# EAGLE design analogControlBoardV1_3 (EAGLE 6.4)
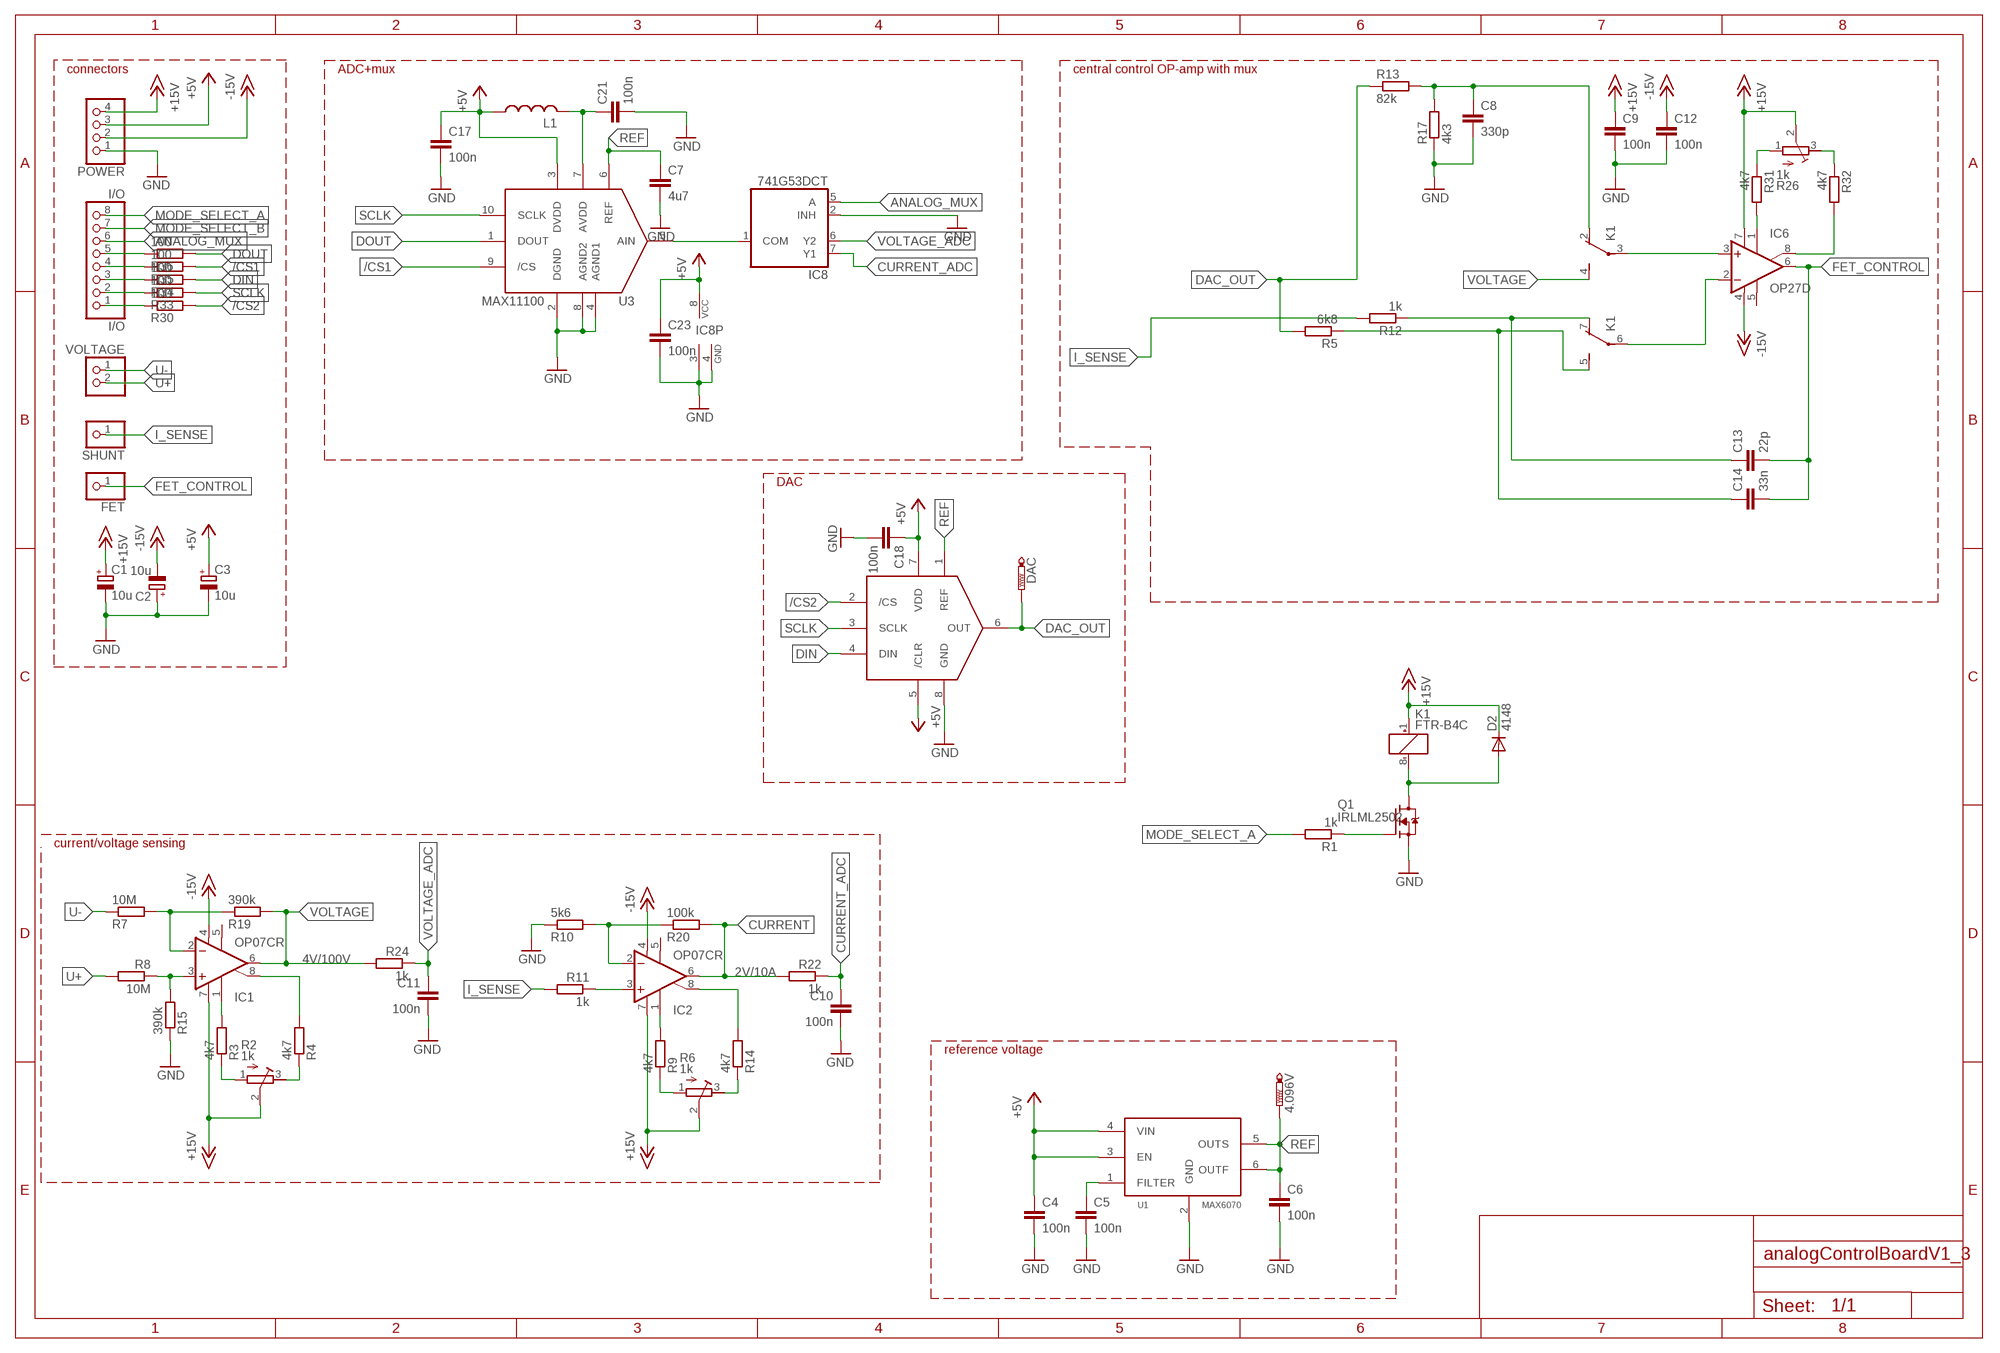
[diagram p0: schematic, sheet 1]

## Parts
4.096V  PTR1TP14R  [TP14R]
C1  10u  CPOL-EU153CLV-0505  [153CLV-0505]
C2  10u  CPOL-EU153CLV-0505  [153CLV-0505]
C3  10u  CPOL-EU153CLV-0505  [153CLV-0505]
C4  100n  C-EUC0603K  [C0603K]
C5  100n  C-EUC0603K  [C0603K]
C6  100n  C-EUC0603K  [C0603K]
C7  4u7  C-EUC0805  [C0805]
C8  330p  C-EUC0603K  [C0603K]
C9  100n  C-EUC0603K  [C0603K]
C10  100n  C-EUC0603K  [C0603K]
C11  100n  C-EUC0603K  [C0603K]
C12  100n  C-EUC0603K  [C0603K]
C13  22p  C-EUC0603K  [C0603K]
C14  33n  C-EUC0603K  [C0603K]
C17  100n  C-EUC0603K  [C0603K]
C18  100n  C-EUC0603K  [C0603K]
C21  100n  C-EUC0603K  [C0603K]
C23  100n  C-EUC0603K  [C0603K]
D2  4148  DIODE-SOD123  [SOD123]
DAC  PTR1TP14R  [TP14R]
FET  PINHD-1X1  [1X01]
I/O  I/O  PINHD-1X8  [1X08]
IC1  OP07CR  [SO08]
IC2  OP07CR  [SO08]
IC6  OP27D  [SO08]
IC8  741G53DCT  [DCT_R-PDSO-G8]
K1  FTR-B4C  [FTR-B4C]
L1  INDUCTOR0603  [R0603]
POWER  PINHD-1X4  [1X04]
Q1  IRLML2502  [SOT23-3]
R1  1k  R-EU_R0603  [R0603]
R2  1k  R-TRIMM64W  [RTRIM64W]
R3  4k7  R-EU_R0603  [R0603]
R4  4k7  R-EU_R0603  [R0603]
R5  6k8  R-EU_R0603  [R0603]
R6  1k  R-TRIMM64W  [RTRIM64W]
R7  10M  R-EU_R0603  [R0603]
R8  10M  R-EU_R0603  [R0603]
R9  4k7  R-EU_R0603  [R0603]
R10  5k6  R-EU_R0603  [R0603]
R11  1k  R-EU_R0603  [R0603]
R12  1k  R-EU_R0603  [R0603]
R13  82k  R-EU_R0603  [R0603]
R14  4k7  R-EU_R0603  [R0603]
R15  390k  R-EU_R0603  [R0603]
R17  4k3  R-EU_R0603  [R0603]
R19  390k  R-EU_R0603  [R0603]
R20  100k  R-EU_R0603  [R0603]
R22  1k  R-EU_R0603  [R0603]
R24  1k  R-EU_R0603  [R0603]
R26  1k  R-TRIMM64W  [RTRIM64W]
R30  100  R-EU_R0603  [R0603]
R31  4k7  R-EU_R0603  [R0603]
R32  4k7  R-EU_R0603  [R0603]
R33  100  R-EU_R0603  [R0603]
R34  100  R-EU_R0603  [R0603]
R35  100  R-EU_R0603  [R0603]
R36  100  R-EU_R0603  [R0603]
SHUNT  PINHD-1X1  [1X01]
U1  MAX6070  [SOT23-6L]
U2  MAX5216  [UMAX8]
U3  MAX11100  [UMAX10]
VOLTAGE  PINHD-1X2  [1X02]

## Nets
+5V: C3.+ C4.1 C17.1 C18.1 C23.1 IC8.8(VCC) L1.1 POWER.3 U1.3(EN) U1.4(VIN) U2.5(/CLR) U2.7(VDD) U3.3(DVDD)
+15V: C1.+ C9.1 D2.C IC1.7(V+) IC2.7(V+) IC6.7(V+) K1.1(K:+) POWER.4 R2.2(S) R6.2(S) R26.2(S)
-15V: C2.- C12.1 IC1.4(V-) IC2.4(V-) IC6.4(V-) POWER.2
/CS1: R35.2 U3.9(/CS)
/CS2: R30.2 U2.2(/CS)
ANALOG_MUX: I/O.6 IC8.5(A)
CURRENT: IC2.6(OUT) R20.2 R22.2
CURRENT_ADC: C10.1 IC8.7(Y1) R22.1
DAC_OUT: DAC.TP R5.2 R13.1 U2.6(OUT)
DIN: R34.2 U2.4(DIN)
DOUT: R36.2 U3.1(DOUT)
FET_CONTROL: C13.2 C14.2 FET.1 IC6.6(OUT)
GND: C1.- C2.+ C3.- C4.2 C5.2 C6.2 C7.2 C8.2 C9.2 C10.2 C11.2 C12.2 C17.2 C18.2 C21.2 C23.2 IC8.2(INH) IC8.3(GND) IC8.4(GND) POWER.1 Q1.2(S) R10.1 R15.1 R17.1 U1.2(GND) U2.8(GND) U3.2(DGND) U3.4(AGND1) U3.8(AGND2)
I_SENSE: R11.2 R12.2 SHUNT.1
MODE_SELECT_A: I/O.8 R1.2
MODE_SELECT_B: I/O.7
N$1: C8.1 K1.2(-1:O) R13.2 R17.2
N$2: D2.A K1.8(K:-) Q1.3(D)
N$3: Q1.1(G) R1.1
N$4: C13.1 K1.7(-2:O) R12.1
N$5: IC2.3(+IN) R11.1
N$6: IC2.2(-IN) R10.2 R20.1
N$7: R2.1(E) R3.1
N$8: IC1.8(ON2) R4.2
N$9: R26.3(A) R32.1
N$10: R2.3(A) R4.1
N$11: IC6.1(ON1) R31.2
N$12: IC1.1(ON1) R3.2
N$13: R6.1(E) R9.1
N$14: IC2.8(ON2) R14.2
N$15: R6.3(A) R14.1
N$16: IC2.1(ON1) R9.2
N$17: I/O.5 R36.1
N$18: I/O.4 R35.1
N$19: I/O.3 R34.1
N$20: I/O.2 R33.1
N$21: I/O.1 R30.1
N$23: IC6.3(+IN) K1.3(-1:P)
N$25: C5.1 U1.1(FILTER)
N$32: IC6.2(-IN) K1.6(-2:P)
N$43: C14.1 K1.5(-2:S) R5.1
N$45: R26.1(E) R31.1
N$46: IC6.8(ON2) R32.2
N$61: C21.1 L1.2 U3.7(AVDD)
N$65: IC8.1(COM) U3.5(AIN)
N$85: IC1.3(+IN) R8.1 R15.2
N$86: IC1.2(-IN) R7.2 R19.1
REF: 4.096V.TP C6.1 C7.1 U1.5(OUTS) U1.6(OUTF) U2.1(REF) U3.6(REF)
SCLK: R33.2 U2.3(SCLK) U3.10(SCLK)
U+: R8.2 VOLTAGE.2
U-: R7.1 VOLTAGE.1
VOLTAGE: IC1.6(OUT) K1.4(-1:S) R19.2 R24.2
VOLTAGE_ADC: C11.1 IC8.6(Y2) R24.1
Unconnected: IC1.5(OPT) IC2.5(OPT) IC6.5(OPT)

## Notes on the sheet
- connectors | ADC+mux | central control OP-amp with mux
- DAC
- current/voltage sensing
- 4V/100V
- 2V/10A
- reference voltage

## Library data of the parts
4.096V DAC = testpad:PTR1: TEST PIN
C1-C3 = rcl:CPOL-EU: POLARIZED CAPACITOR, European symbol
C4-C14 C17 C18 C21 C23 = rcl:C-EU: CAPACITOR, European symbol
D2 = diode:DIODE-: DIODE
FET SHUNT = pinhead:PINHD-1X1: PIN HEADER
I/O = pinhead:PINHD-1X8: PIN HEADER
IC1 IC2 = linear:OP07*: OP AMP
IC6 = linear:OP27: OP AMP
IC8 = 74xx-little-us:74*1G53: SINGLE-POLE DOUBLE-THROW (SPDT) ANALOG SWITCH 2:1 ANALOG MULTIPLEXER/DEMULTIPLEXER Source: http://focus.ti.com/lit/ds/symlink/sn74lvc2g53.pdf
K1 = relay:FTR-B4: ULTRA MINIATURE RELAY 2 POLES - 2 A (Slim Profile Signal Relay) FUJITSU FTR-B4 SERIES Source: FTR-B4.pdf
L1 = xmaker:INDUCTOR: Inductor
POWER = pinhead:PINHD-1X4: PIN HEADER
Q1 = xmaker:IRLML2502: International Rectifier N-MOSFET.
R1 R3-R5 R7-R15 R17 R19 R20 R22 R24 R30-R36 = resistor:R-EU_: RESISTOR, European symbol
R2 R6 R26 = resistor:R-TRIMM: Trimm resistor
U1 = maxim:MAX6070
U2 = maxim:MAX5216
U3 = maxim:MAX11100
VOLTAGE = pinhead:PINHD-1X2: PIN HEADER

## Board
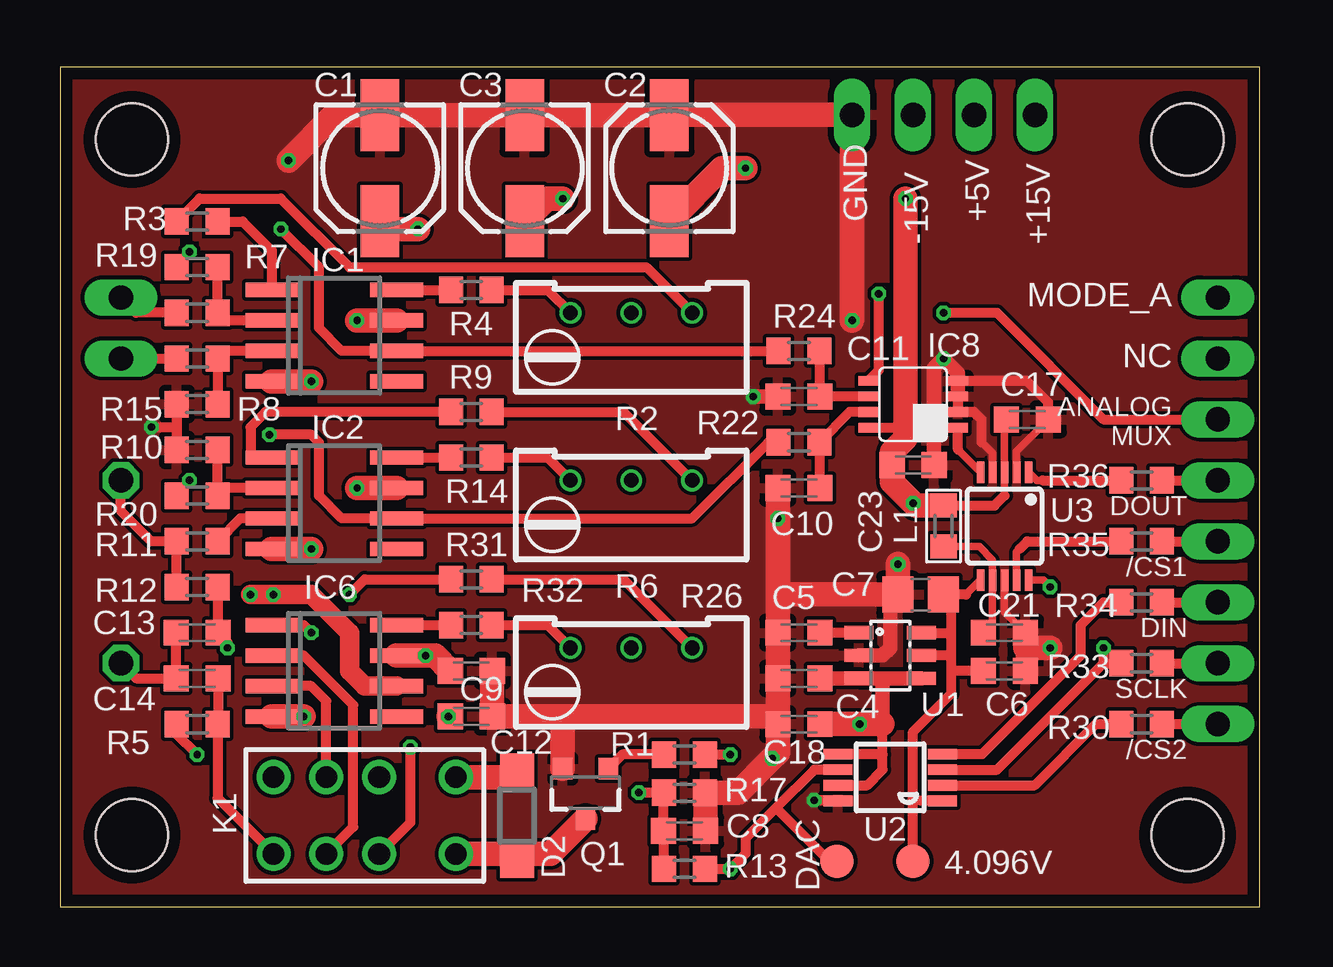
[diagram p1: board, top side]
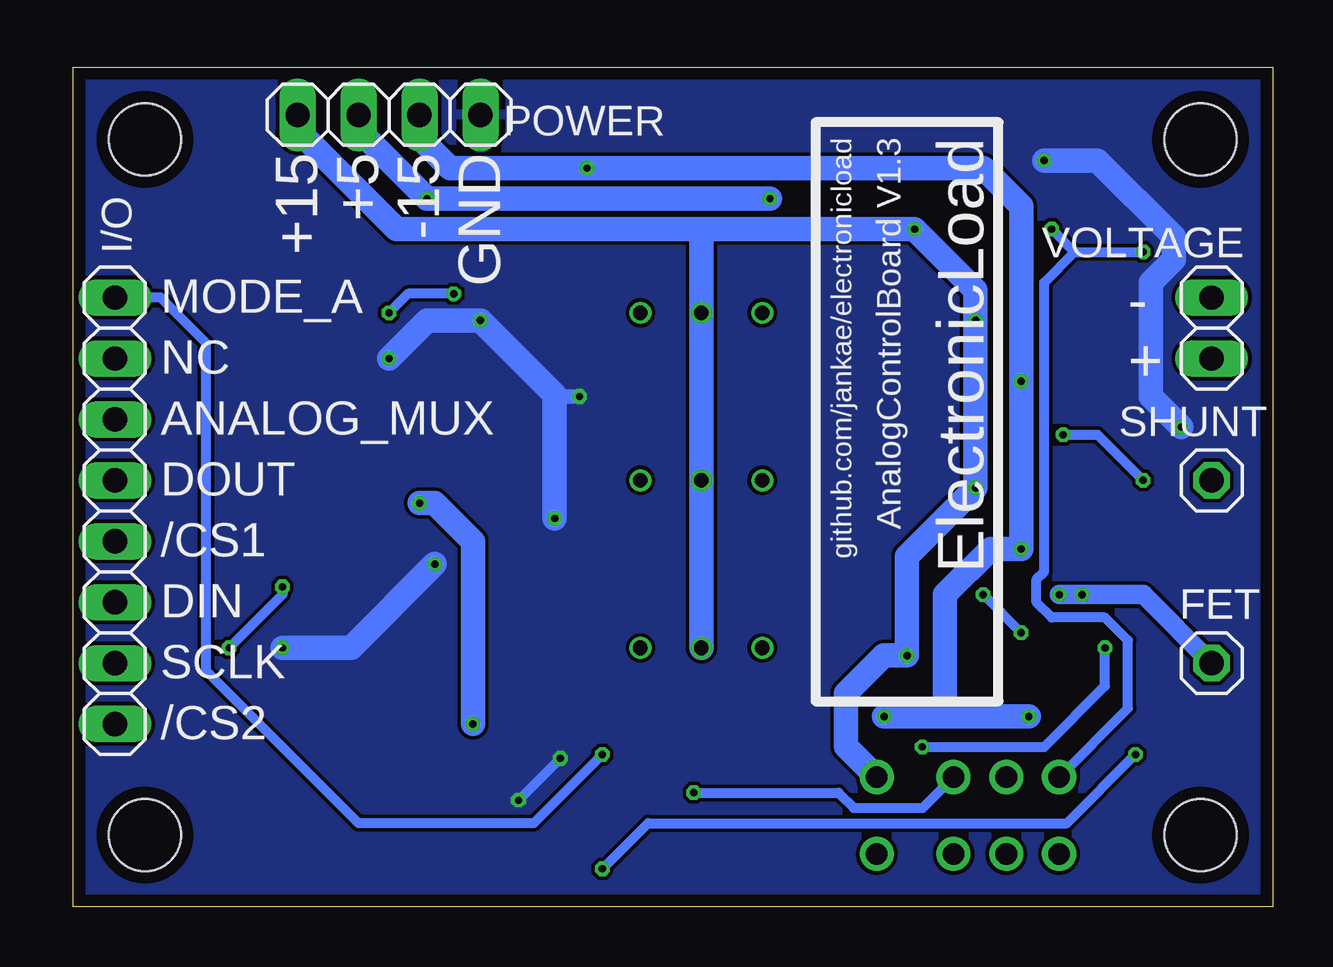
[diagram p2: board, bottom side, seen from below]

Size 50 x 35 mm. Coordinates in mm from the lower left corner, seen from the top.
Outline: 0,0 50,0 50,35 0,35 0,0
Copper layers (1*16): Top 0.035mm / dielectric 1.6mm / Bottom 0.035mm
Design rules "Elecrow_2-layer_PCB_eagle_rule": minimum track width 6mil, minimum drill 12mil, track to track 6mil, track to pad 6mil, pad to pad 6mil, via to via 8mil, smd to smd 0mil, copper to edge 20mil, drill to drill 10mil, minimum pad ring 6mil, minimum via ring 6mil, stop-mask expansion 0mil, vias tented up to drill 100mil, thermal gap 10mil
Holes 3 mm at 3,32 3,3 47,3 47,32

### Footprints (pad centres in the part's own frame; a part is rotated, then mirrored left to right if it is on the bottom)
TP14R = smd 1.4 x 1.4: TP 0,0
153CLV-0505 = smd 3 x 1.6: + 2.2,0; - -2.2,0
C0603K = smd 1.05 x 1.08: 1 -0.875,0; 2 0.875,0
C0805 = smd 1.3 x 1.5: 1 -0.95,0; 2 0.95,0
SOD123 = smd 1.4 x 1.4: A 1.9,0; C -1.9,0
1X01 = drill 1.016 octagon: 1 0,0
1X08 = drill 1.016 long: 1 -8.89,0; 2 -6.35,0; 3 -3.81,0; 4 -1.27,0; 5 1.27,0; 6 3.81,0; 7 6.35,0; 8 8.89,0
SO08 = smd 0.6 x 2.2: 1 -1.905,-2.6; 2 -0.635,-2.6; 3 0.635,-2.6; 4 1.905,-2.6; 5 1.905,2.6; 6 0.635,2.6; 7 -0.635,2.6; 8 -1.905,2.6
DCT_R-PDSO-G8 = smd 0.4 x 0.8: 1 -0.975,-1.875; 2 -0.325,-1.875; 3 0.325,-1.875; 4 0.975,-1.875; 5 0.975,1.875; 6 0.325,1.875; 7 -0.325,1.875; 8 -0.975,1.875
FTR-B4C = drill 0.9 pad 1.422: 1 -3.8,-1.6; 2 -0.6,-1.6; 3 1.6,-1.6; 4 3.8,-1.6; 5 3.8,1.6; 6 1.6,1.6; 7 -0.6,1.6; 8 -3.8,1.6
R0603 = smd 1.1 x 1: 1 0,-0.85; 2 0,0.85
1X04 = drill 1.016 long: 1 -3.81,0; 2 -1.27,0; 3 1.27,0; 4 3.81,0
SOT23-3 = smd 0.8 x 0.9: 1 -0.95,-1; 2 0.95,-1; 3 0,1.1
R0603' = smd 1 x 1.1: 1 -0.85,0; 2 0.85,0
RTRIM64W = drill 0.61: 1 1.27,-2.54; 2 1.27,0; 3 1.27,2.54
SOT23-6L = smd 0.55 x 1.2: 1 -0.95,-1.3; 2 0,-1.3; 3 0.95,-1.3; 4 0.95,1.3; 5 0,1.3; 6 -0.95,1.3
UMAX8 = smd 0.45 x 1.2: 1 -0.975,-2.175; 2 -0.325,-2.175; 3 0.325,-2.175; 4 0.975,-2.175; 5 0.975,2.175; 6 0.325,2.175; 7 -0.325,2.175; 8 -0.975,2.175
UMAX10 = smd 0.32 x 0.9: 1 -1,-2.25; 2 -0.5,-2.25; 3 0,-2.25; 4 0.5,-2.25; 5 1,-2.25; 6 1,2.25; 7 0.5,2.25; 8 0,2.25; 9 -0.5,2.25; 10 -1,2.25
1X02 = drill 1.016 long: 1 -1.27,0; 2 1.27,0

### Placement (x,y rotation side)
4.096V  35.56,1.91 0 top
C1  13.34,30.8 270 top
C2  25.4,30.8 90 top
C3  19.37,30.8 270 top
C4  30.8,9.53 180 top
C5  30.8,11.43 180 top
C6  39.37,9.84 0 top
C7  35.88,13.02 180 top
C8  26.04,3.17 0 top
C9  17.14,9.84 0 top
C10  30.8,17.46 180 top
C11  30.8,21.27 180 top
C12  17.14,7.94 0 top
C13  5.71,11.43 180 top
C14  5.71,9.53 180 top
C17  40.32,20.32 0 top
C18  30.8,7.62 180 top
C21  39.37,11.43 0 top
C23  35.56,18.41 0 top
D2  19.05,3.81 270 top
DAC  32.38,1.91 0 top
FET  2.54,10.16 0 bottom
I/O  48.26,16.51 90 bottom
IC1  11.43,23.81 270 top
IC2  11.43,16.83 270 top
IC6  11.43,9.84 270 top
IC8  35.56,20.95 90 top
K1  12.7,3.81 180 top
L1  36.83,15.88 180 top
POWER  36.83,33.02 180 bottom
Q1  21.91,4.76 180 top
R1  1k  [R0603']  26.04,6.35 0 top
R2  23.81,23.5 90 top
R3  4k7  [R0603']  5.71,28.57 0 top
R4  4k7  [R0603']  17.14,25.72 180 top
R5  6k8  [R0603']  5.71,7.62 180 top
R6  23.81,16.51 90 top
R7  10M  [R0603']  5.71,24.77 0 top
R8  10M  [R0603']  5.71,22.86 180 top
R9  4k7  [R0603']  17.14,20.64 180 top
R10  5k6  [R0603']  5.71,19.05 0 top
R11  1k  [R0603']  5.71,15.24 180 top
R12  1k  [R0603']  5.71,13.34 180 top
R13  82k  [R0603']  26.04,1.59 180 top
R14  4k7  [R0603']  17.14,18.73 180 top
R15  390k  [R0603']  5.71,20.95 0 top
R17  4k3  [R0603']  26.04,4.76 180 top
R19  390k  [R0603']  5.71,26.67 180 top
R20  100k  [R0603']  5.71,17.14 180 top
R22  1k  [R0603']  30.8,19.37 180 top
R24  1k  [R0603']  30.8,23.18 180 top
R26  23.81,9.53 90 top
R30  100  [R0603']  45.09,7.62 180 top
R31  4k7  [R0603']  17.14,13.65 180 top
R32  4k7  [R0603']  17.14,11.75 180 top
R33  100  [R0603']  45.09,10.16 180 top
R34  100  [R0603']  45.09,12.7 180 top
R35  100  [R0603']  45.09,15.24 180 top
R36  100  [R0603']  45.09,17.78 180 top
SHUNT  2.54,17.78 0 bottom
U1  34.61,10.48 270 top
U2  34.61,5.4 90 top
U3  39.37,15.88 180 top
VOLTAGE  2.54,24.13 270 bottom

### Tracks (layer width: path | path; a pad name or v marks a point on that pad's centre or on a via)
+5V  (via drill 0.3)
  Top 0.305: 39.37,17.14 U3.3 39.37,20.08
  Top 0.406: U2.5 34.27,6.37 34.29,6.35 | U2.7 33.65,5.07 34.29,5.71 34.29,6.35 | 34.29,6.35 34.29,7.62 | L1.1 38.95,16.73 39.37,17.14 | 39.37,20.08 C17.1 | IC8.8 35.22,19.98 35.24,20
  Top 0.61: C4.1 U1.3 U1.4 34.29,9.53 34.29,7.62
  Top 1.016: v20.95,29.53 20.3,29.53 C3.+ | v35.24,29.53 35.24,20 35.24,19.53 34.69,18.97 C23.1 34.69,17.7 v35.56,16.83 35.66,16.73 L1.1 | 34.29,7.62 v33.34,7.62 C18.1
  Bottom 1.016: POWER.3 38.1,32.38 v35.24,29.53 v20.95,29.53 | v35.56,16.83 34.92,16.83 33.34,15.24 v33.34,7.62
+15V  (via drill 0.3)
  Top 1.016: v14.92,28.26 13.68,28.26 C1.+ | IC1.7 v12.38,24.45 | IC2.7 v12.38,17.46 | C9.1 15.63,10.48 v15.24,10.48 IC6.7 | D2.C 18.75,5.41 K1.1
  Bottom 1.016: POWER.4 40.64,32.38 36.51,28.26 23.81,28.26 | 23.81,28.26 v14.92,28.26 12.38,25.72 v12.38,24.45 v12.38,17.46 15.24,14.61 v15.24,10.48 16.19,10.48 17.78,8.89 17.78,6.69 K1.1 | R2.2 R6.2 R26.2 23.81,28.26
-15V  (via drill 0.3)
  Top 1.016: v28.57,30.8 27.6,30.8 C2.- | IC6.4 v10.16,7.94 | IC1.4 v10.48,21.91 | IC2.4 v10.48,14.92 | C12.1 v16.19,7.94
  Bottom 1.016: POWER.2 35.56,32.07 34.29,30.8 v28.57,30.8 12.06,30.8 10.48,29.21 v10.48,21.91 v10.48,14.92 11.75,14.92 13.65,13.02 13.65,7.94 | v16.19,7.94 13.65,7.94 | v10.16,7.94 13.65,7.94
/CS1
  Top 0.305: U3.9 39.87,14.79 40.01,14.92
  Top 0.406: 40.01,14.92 40.32,15.24 R35.2
/CS2
  Top 0.406: U2.2 40.63,5.07 43.18,7.62 R30.2
ANALOG_MUX  (via drill 0.3)
  Top 0.406: IC8.5 34.13,22.38 v34.13,25.56 | v36.83,24.77 39.05,24.77 43.5,20.32 I/O.6
  Bottom 0.406: v34.13,25.56 36.04,25.56 v36.83,24.77
CURRENT  (via drill 0.3)
  Top 0.406: v8.73,19.68 10.48,19.68 10.79,19.37 10.79,17.14 11.75,16.19 IC2.6 26.35,16.19 29.53,19.37 R22.2 | v5.4,17.78 R20.2
  Bottom 0.406: v8.73,19.68 7.3,19.68 v5.4,17.78
CURRENT_ADC
  Top 0.406: C10.1 31.67,19.34 R22.1 32.91,20.63 IC8.7
DAC_OUT  (via drill 0.3)
  Top 0.406: R13.1 v27.94,1.59 28.57,2.22 28.57,2.86 29.84,4.13 | v5.71,6.35 4.87,7.2 R5.2 | U2.6 31.44,5.72 29.84,4.13 | DAC.TP 32.07,1.91 29.84,4.13
  Bottom 0.406: v27.94,1.59 26.04,3.49 8.57,3.49 v5.71,6.35
DIN
  Top 0.406: U2.4 38.44,6.37 42.55,10.48 42.55,11.75 43.5,12.7 R34.2
DOUT
  Top 0.305: U3.1 40.72,17.78 40.96,17.78
  Top 0.406: 40.96,17.78 R36.2
FET_CONTROL  (via drill 0.3)
  Top 0.406: C13.2 C14.2 3.17,9.53 FET.1
  Top 0.813: IC6.6 12.7,9.21 12.06,9.84 12.06,11.43 10.48,13.02 v8.89,13.02 v7.94,13.02
  Bottom 0.813: v8.89,13.02 5.4,13.02 FET.1
GND  (via drill 0.3)
  Top 0.305: U3.4 38.87,18.91 38.42,19.37 | U3.2 39.87,18.99 C17.2 | U3.8 39.37,12.3 C21.2
  Top 0.406: 13.31,33.02 C1.- | U2.8 32.41,4.45 v31.43,4.45 | 38.42,19.37 38.42,20.32 38.1,20.64 IC8.2 IC8.3 | C17.2 41.2,21.03 40.3,21.93 IC8.4 | R15.1 4.87,20 | 4.87,20 R10.1 | v3.81,20 4.87,20
  Top 0.61: C11.2 v28.89,21.27 | U1.2 34.29,10.48 34.61,10.79 34.61,12.7 C7.2 | C23.2 36.44,22.46 v36.83,22.86 37.44,22.25 IC8.4 IC8.3
  Top 0.813: C6.2 40.24,10.79 C21.2
  Top 1.016: 26.04,33.02 POWER.1 v33.02,24.45 | 26.04,33.02 25.42,33.02 C2.+ | 26.04,33.02 26.01,33 C3.- C1.- 11.41,33 v9.53,31.11 | 20.96,6.67 Q1.2 20.95,7.94 | 20.95,7.94 C12.2 C9.2 | C8.2 26.91,4.74 R17.1 28.26,4.76 v29.69,6.19 29.92,6.43 C18.2 29.92,8.26 | 29.92,8.26 C4.2 C5.2 29.92,13.02 | C10.2 v29.92,16.19 29.92,13.02 | 29.92,13.02 C7.2 v34.92,14.29 | 20.95,7.94 29.61,7.94 29.92,8.26 | v41.27,10.79 40.24,10.79
  Bottom 0.406: v31.43,4.45 v29.69,6.19
  Bottom 0.61: v28.89,21.27 29.84,21.27 29.92,21.35
  Bottom 1.016: v29.92,16.19 29.92,21.35 v33.02,24.45 35.24,24.45 v36.83,22.86 | v34.92,14.29 38.42,10.79 v41.27,10.79 | v9.53,31.11 7.3,31.11 4.13,27.94 4.13,26.99 5.08,26.04 5.08,21.27 v3.81,20
  pour Top: -1.27,36.2 50.48,36.2 50.16,-0.64 -1.27,-0.64
  pour Bottom: -0.64,35.56 51.12,35.56 51.12,-1.59 -0.64,-1.59
I_SENSE
  Top 0.406: R12.2 R11.2 3.81,15.24 2.54,16.51 SHUNT.1
MODE_SELECT_A  (via drill 0.3)
  Top 0.406: R1.2 v27.94,6.35
  Bottom 0.406: v27.94,6.35 30.8,3.49 38.1,3.49 44.45,9.84 44.45,23.5 46.35,25.4 I/O.8
N$1  (via drill 0.3)
  Top 0.406: R13.2 25.18,3.15 C8.1 25.16,4.74 R17.2 v24.13,4.76
  Bottom 0.406: v24.13,4.76 18.1,4.76 17.46,4.13 14.58,4.13 K1.2
N$2
  Top 1.016: D2.A 18.75,2.21 K1.8 20.45,2.21 Q1.3
N$3
  Top 0.406: R1.1 23.45,6.35 Q1.1
N$4  (via drill 0.3)
  Top 0.406: R12.1 6.57,11.46 C13.1 6.99,11.04 v6.99,10.79 | K1.7 14.61,3.52 v14.61,6.67
  Bottom 0.406: v14.61,6.67 9.53,6.67 6.99,9.21 v6.99,10.79
N$5
  Top 0.406: IC2.3 7.52,16.19 R11.1
N$6
  Top 0.406: IC2.2 6.88,17.46 R20.1 R10.2
N$7
  Top 0.406: R3.1 5.82,29.53 9.21,29.53 12.06,26.67 24.45,26.67 R2.1
N$8
  Top 0.406: IC1.8 R4.2
N$9
  Top 0.406: R32.1 20.32,11.75 R26.3
N$10
  Top 0.406: R4.1 20.32,25.72 R2.3
N$11  (via drill 0.3)
  Top 0.406: IC6.1 10.16,11.75 v10.48,11.43 | v12.06,13.02 12.7,13.65 R31.2
  Bottom 0.406: v10.48,11.43 v12.06,13.02
N$12
  Top 0.406: R3.2 7.62,28.57 8.83,27.36 IC1.1
N$13
  Top 0.406: R9.1 23.5,20.64 R6.1
N$14
  Top 0.406: IC2.8 R14.2
N$15
  Top 0.406: R14.1 20.32,18.73 R6.3
N$16
  Top 0.406: R9.2 8.57,20.64 7.94,20 7.94,18.73 IC2.1
N$17
  Top 0.406: R36.1 I/O.5
N$18
  Top 0.406: R35.1 I/O.4
N$19
  Top 0.406: R34.1 I/O.3
N$20
  Top 0.406: R33.1 I/O.2
N$21
  Top 0.406: R30.1 I/O.1
N$23
  Top 0.406: K1.3 11.1,8.59 10.48,9.21 IC6.3
N$25
  Top 0.406: U1.1 C5.1
N$32
  Top 0.406: K1.6 12.22,3.33 12.22,8.41 10.16,10.48 IC6.2
N$43
  Top 0.406: C14.1 6.59,7.64 R5.1 6.57,4.54 K1.5
N$45
  Top 0.406: R31.1 23.5,13.65 R26.1
N$46
  Top 0.406: IC6.8 R32.2
N$61
  Top 0.305: C21.1 38.87,11.8 U3.7 38.87,14.47 38.31,15.03 L1.2
N$65
  Top 0.305: 37.44,19.06 U3.5
  Top 0.406: 37.44,19.06 IC8.1
N$85
  Top 0.406: IC1.3 6.88,23.18 R8.1 R15.2
N$86
  Top 0.406: IC1.2 6.88,24.45 R7.2 R19.1
REF
  Top 0.305: 37.76,13.02 U3.6
  Top 0.406: U2.1 35.9,4.42 35.56,4.45 | 35.56,4.45 35.56,7.3 37.15,8.89 37.15,9.84 | 37.15,9.84 37.15,10.48 | 37.15,10.48 37.15,11.43 | 37.15,11.43 37.15,13.02 | 37.15,13.02 37.15,13.34 | 37.15,10.48 U1.5 | U1.6 37.15,11.43 | 37.76,13.02 37.15,13.02 | C7.1 37.15,13.02 | C6.1 37.15,9.84 | 4.096V.TP 35.56,4.45
SCLK  (via drill 0.3)
  Top 0.305: U3.10 40.98,13.62 v41.27,13.34
  Top 0.406: U2.3 39.06,5.72 43.5,10.16 | 43.5,10.16 R33.2 | v43.5,10.79 43.5,10.16
  Bottom 0.406: v41.27,13.34 41.27,13.02 v43.5,10.79
U+
  Top 0.406: VOLTAGE.2 R8.2
U-
  Top 0.406: VOLTAGE.1 3.17,24.77 R7.1
VOLTAGE  (via drill 0.3)
  Top 0.406: v9.21,28.26 10.79,26.67 10.79,24.13 11.75,23.18 IC1.6 R24.2 | v5.4,27.3 4.87,26.77 R19.2
  Bottom 0.406: v9.21,28.26 8.26,27.3 | 8.26,27.3 v5.4,27.3 | K1.4 6.03,8.28 6.03,11.11 6.99,12.06 9.21,12.06 9.84,12.7 9.84,13.65 9.53,13.97 9.53,26.04 8.26,27.3
VOLTAGE_ADC
  Top 0.406: R24.1 31.65,21.3 C11.1 IC8.6

### Text on the board
tPlace: GND | +5V | -15V | +15V | DOUT | /CS1 | DIN | SCLK | /CS2
bPlace: ElectronicLoad | AnalogControlBoard V1.3 | github.com/jankae/electronicload | GND | -15 | +5 | +15 | MODE_A | - | + | NC | ANALOG_MUX | DOUT | /CS1 | DIN | SCLK | /CS2
tNames: MODE_A | NC | ANALOG / MUX